# EAGLE design CS-O-MOTOR-VERT (EAGLE 6.4)
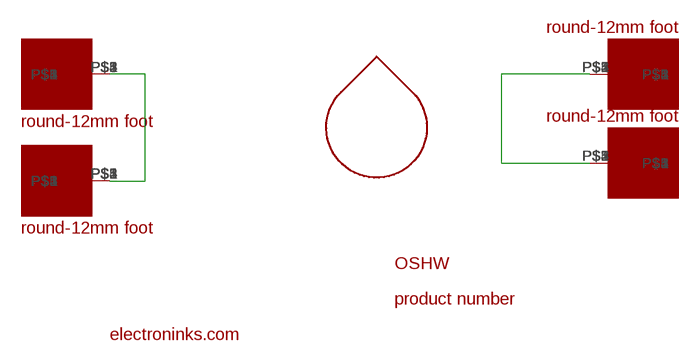
[diagram p0: schematic, sheet 1]

## Parts
U$1  ROUND-12MM-FOOT-1.8MM  [ROUND-12MM-FOOT]
U$2  ROUND-12MM-FOOT-1.8MM  [ROUND-12MM-FOOT]
U$3  ROUND-12MM-FOOT-1.8MM  [ROUND-12MM-FOOT]
U$4  ROUND-12MM-FOOT-1.8MM  [ROUND-12MM-FOOT]
U$5  DROPLET_LOGO_4MM  [DROPLET_LOGO_4MM]
U$6  OSHW_4MM  [OHSW_4MM]
U$7  ELECTRONINKS_COM_15MM  [ELECTRONINKS_COM_15MM]
U$8  CS_O_MOTOR_VERT  [CS_O_MOTOR_VERT]

## Nets
N$1: U$1.P$1 U$2.P$1
N$2: U$3.P$1 U$4.P$1
Unconnected: U$1.P$2 U$1.P$3 U$1.P$4 U$1.P$5 U$2.P$2 U$2.P$3 U$2.P$4 U$2.P$5 U$3.P$2 U$3.P$3 U$3.P$4 U$3.P$5 U$4.P$2 U$4.P$3 U$4.P$4 U$4.P$5

## Library data of the parts
U$1-U$4 = electroninks:ROUND-12MM-FOOT-1.8MM
U$5 = electroninks:DROPLET_LOGO_4MM
U$6 = electroninks:OSHW_4MM
U$7 = electroninks:ELECTRONINKS_COM_15MM
U$8 = electroninks:CS_O_MOTOR_VERT

## Board
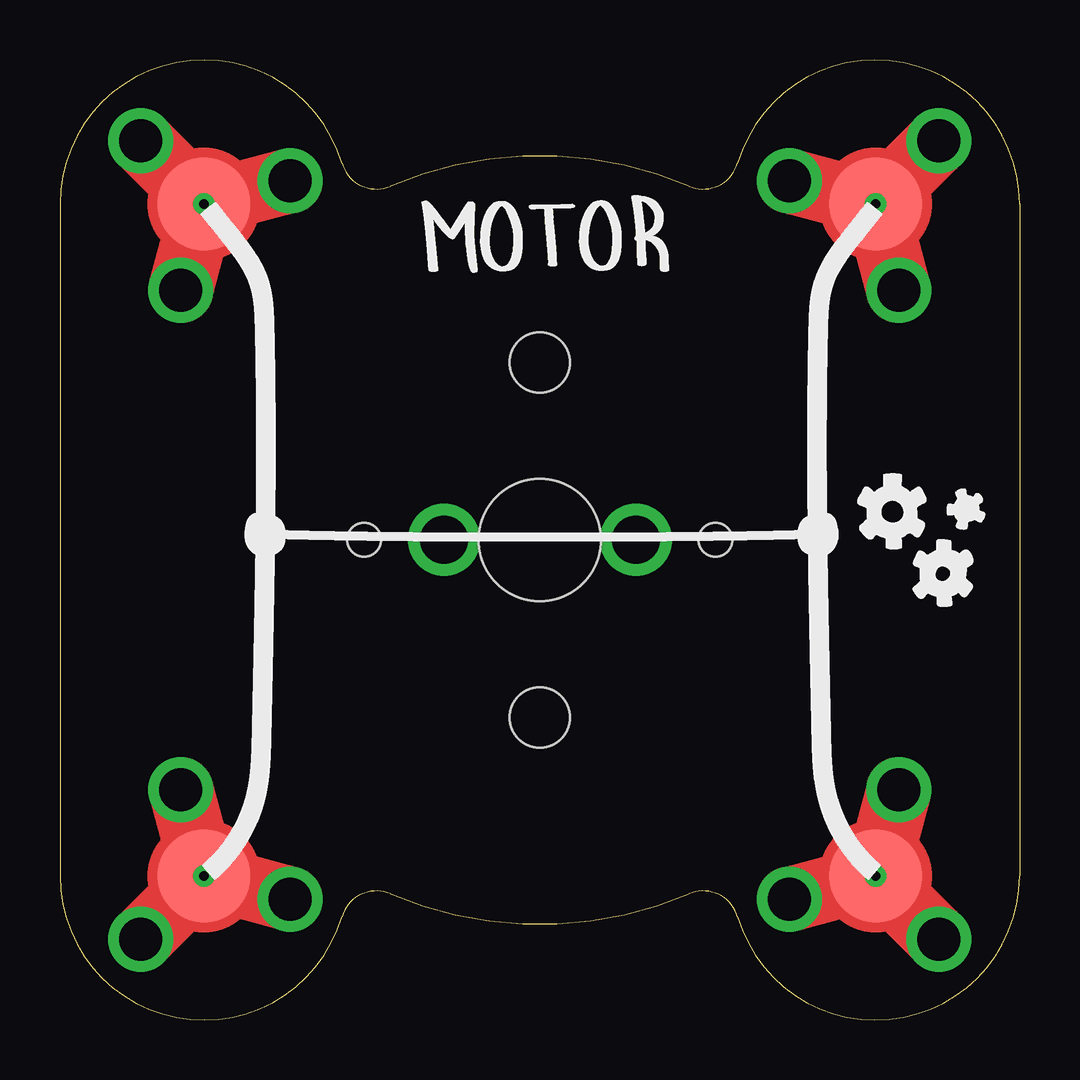
[diagram p1: board, top side]
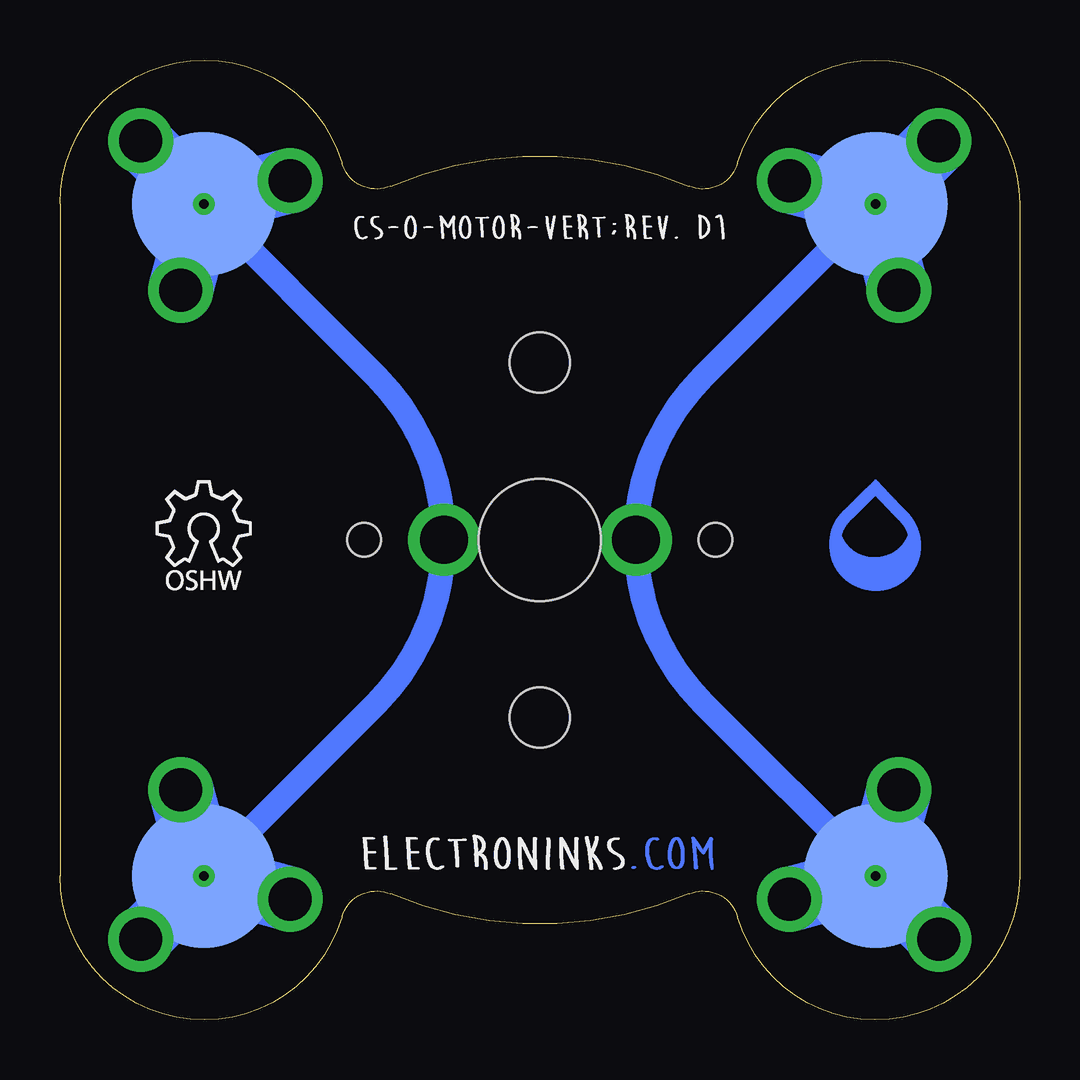
[diagram p2: board, bottom side, seen from below]

Size 40 x 40 mm. Coordinates in mm from the lower left corner, seen from the top.
Outline: 0,34 0,6 arc164 11.76,4.3 arc-96 13.78,5.26 arc46 26.22,5.26 arc-96 28.25,4.3 arc164 40,6 40,34 arc164 28.25,35.7 arc-96 26.22,34.74 arc46 13.78,34.74 arc-96 11.76,35.7 arc164 0,34
Copper layers (1*16): Top 0.035mm / dielectric 1.5mm / Bottom 0.035mm
Design rules "default *": minimum track width 10mil, minimum drill 24mil, track to track 20mil, track to pad 20mil, pad to pad 20mil, via to via 20mil, smd to smd 20mil, copper to edge 0.000025mm, drill to drill 8mil, minimum pad ring 10mil, minimum via ring 8mil, stop-mask expansion 4mil, vias tented up to drill 0mil, thermal gap 10mil
Holes 5.1 mm at 20,20
Holes 2.5 mm at 20,27.4 20,12.6
Holes 1.4 mm at 12.67,20 27.33,20

### Footprints (pad centres in the part's own frame; a part is rotated, then mirrored left to right if it is on the bottom)
ROUND-12MM-FOOT = drill 1.8: P$1 -3.726,0; P$2 1.863,3.227; P$3 1.863,-3.227 | smd 3.85 x 3.85: P$4 0,0 | smd 6 x 6 bottom: P$5 0,0 | drill 0.4: P$6 0,0

### Placement (x,y rotation side)
U$1  6,34 75 top
U$2  6,6 45 top
U$3  34,34 225 top
U$4  34,6 135 top
U$5  6,19.37 0 bottom
U$6  36,17.62 0 bottom
U$7  27.62,5.87 0 bottom
U$8  27.88,32.25 0 bottom

### Tracks (layer width: path | path; a pad name or v marks a point on that pad's centre or on a via)
N$1  (via drill 2 pad 0.61)
  Bottom 1.016: 6,34 13.17,26.83 arc-45 v16,20 arc-45 13.17,13.17 6,6
N$2  (via drill 2)
  Bottom 1.016: 34,34 26.83,26.83 arc45 v24,20 arc45 26.83,13.17 34,6